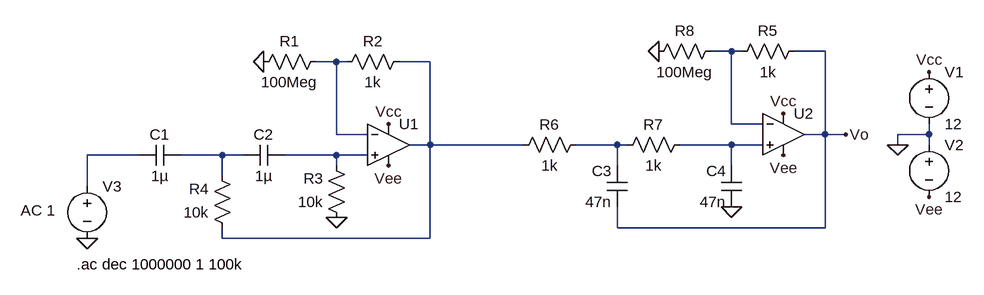
[diagram p0: schematic bandpass_filter_AC.asc]
bandpass_filter_AC.asc, the LTspice schematic file:
Version 4
SHEET 1 1080 680
WIRE 720 48 688 48
WIRE 736 48 720 48
WIRE 864 48 816 48
WIRE 112 64 80 64
WIRE 128 64 112 64
WIRE 256 64 208 64
WIRE 720 160 720 48
WIRE 768 160 720 160
WIRE 112 176 112 64
WIRE 160 176 112 176
WIRE 864 176 864 48
WIRE 864 176 832 176
WIRE 896 176 864 176
WIRE 1024 176 1024 160
WIRE 1024 176 976 176
WIRE 256 192 256 64
WIRE 256 192 224 192
WIRE 400 192 256 192
WIRE 544 192 480 192
WIRE 560 192 544 192
WIRE 720 192 640 192
WIRE 768 192 720 192
WIRE 976 192 976 176
WIRE 1024 192 1024 176
WIRE -192 208 -272 208
WIRE -64 208 -128 208
WIRE -32 208 -64 208
WIRE 112 208 32 208
WIRE 160 208 112 208
WIRE 112 224 112 208
WIRE 544 224 544 192
WIRE 720 224 720 192
WIRE -64 240 -64 208
WIRE -272 256 -272 208
WIRE 544 320 544 288
WIRE 864 320 864 176
WIRE 864 320 544 320
WIRE -64 336 -64 320
WIRE 256 336 256 192
WIRE 256 336 -64 336
FLAG 976 192 0
FLAG 1024 80 Vcc
FLAG 192 160 Vcc
FLAG 1024 272 Vee
FLAG 192 224 Vee
FLAG 112 304 0
FLAG -272 336 0
FLAG 0 64 0
FLAG 800 144 Vcc
FLAG 800 208 Vee
FLAG 896 176 Vo
FLAG 720 288 0
FLAG 608 48 0
SYMBOL Opamps\\UniversalOpamp2 192 192 R0
SYMATTR InstName U1
SYMBOL voltage 1024 64 R0
WINDOW 123 0 0 Left 0
WINDOW 39 0 0 Left 0
SYMATTR InstName V1
SYMATTR Value 12
SYMBOL voltage 1024 176 R0
WINDOW 123 0 0 Left 0
WINDOW 39 0 0 Left 0
SYMATTR InstName V2
SYMATTR Value 12
SYMBOL res 224 48 R90
WINDOW 0 0 56 VBottom 2
WINDOW 3 32 56 VTop 2
SYMATTR InstName R2
SYMATTR Value 1k
SYMBOL res 128 320 R180
WINDOW 0 36 76 Left 2
WINDOW 3 36 40 Left 2
SYMATTR InstName R3
SYMATTR Value 10k
SYMBOL cap -128 192 R90
WINDOW 0 0 32 VBottom 2
WINDOW 3 32 32 VTop 2
SYMATTR InstName C1
SYMATTR Value 1µ
SYMBOL res -48 336 R180
WINDOW 0 36 76 Left 2
WINDOW 3 36 40 Left 2
SYMATTR InstName R4
SYMATTR Value 10k
SYMBOL cap 32 192 R90
WINDOW 0 0 32 VBottom 2
WINDOW 3 32 32 VTop 2
SYMATTR InstName C2
SYMATTR Value 1µ
SYMBOL voltage -272 240 R0
WINDOW 3 24 152 Invisible 2
WINDOW 123 -102 53 Left 2
WINDOW 39 0 0 Left 0
SYMATTR Value ""
SYMATTR Value2 AC 1
SYMATTR InstName V3
SYMBOL res 96 48 R90
WINDOW 0 0 56 VBottom 2
WINDOW 3 32 56 VTop 2
SYMATTR InstName R1
SYMATTR Value 100Meg
SYMBOL Opamps\\UniversalOpamp2 800 176 R0
SYMATTR InstName U2
SYMBOL res 832 32 R90
WINDOW 0 0 56 VBottom 2
WINDOW 3 32 56 VTop 2
SYMATTR InstName R5
SYMATTR Value 1k
SYMBOL res 704 32 R90
WINDOW 0 0 56 VBottom 2
WINDOW 3 32 56 VTop 2
SYMATTR InstName R8
SYMATTR Value 100Meg
SYMBOL res 384 208 R270
WINDOW 0 32 56 VTop 2
WINDOW 3 0 56 VBottom 2
SYMATTR InstName R6
SYMATTR Value 1k
SYMBOL res 544 208 R270
WINDOW 0 32 56 VTop 2
WINDOW 3 0 56 VBottom 2
SYMATTR InstName R7
SYMATTR Value 1k
SYMBOL cap 560 288 R180
WINDOW 0 24 56 Left 2
WINDOW 3 24 8 Left 2
SYMATTR InstName C3
SYMATTR Value 47n
SYMBOL cap 736 288 R180
WINDOW 0 24 56 Left 2
WINDOW 3 24 8 Left 2
SYMATTR InstName C4
SYMATTR Value 47n
TEXT -288 376 Left 2 !.ac dec 1000000 1 100k

The netlist it stands for:
* bandpass_filter_AC.asc
XU1 N008 N002 Vcc Vee N003 level.2 Avol=1Meg GBW=10Meg Slew=10Meg ilimit=25m rail=0 Vos=0 phimargin=45 en=0 enk=0 in=0 ink=0 Rin=500Meg  ; pins IN+ IN- V+ V- OUT
V1 Vcc 0 12
V2 0 Vee 12
R2 N003 N002 1k
R3 0 N008 10k
C1 N007 N006 1µ
R4 N003 N007 10k
C2 N008 N007 1µ
V3 N006 0 AC 1
R1 N002 0 100Meg
XU2 N005 N001 Vcc Vee Vo level.2 Avol=1Meg GBW=10Meg Slew=10Meg ilimit=25m rail=0 Vos=0 phimargin=45 en=0 enk=0 in=0 ink=0 Rin=500Meg  ; pins IN+ IN- V+ V- OUT
R5 Vo N001 1k
R8 N001 0 100Meg
R6 N003 N004 1k
R7 N004 N005 1k
C3 Vo N004 47n
C4 0 N005 47n
.ac dec 1000000 1 100k
.lib UniversalOpamps2.sub
.backanno
.end